# Altium schematic sheet Sheet1.SchDoc
size A4
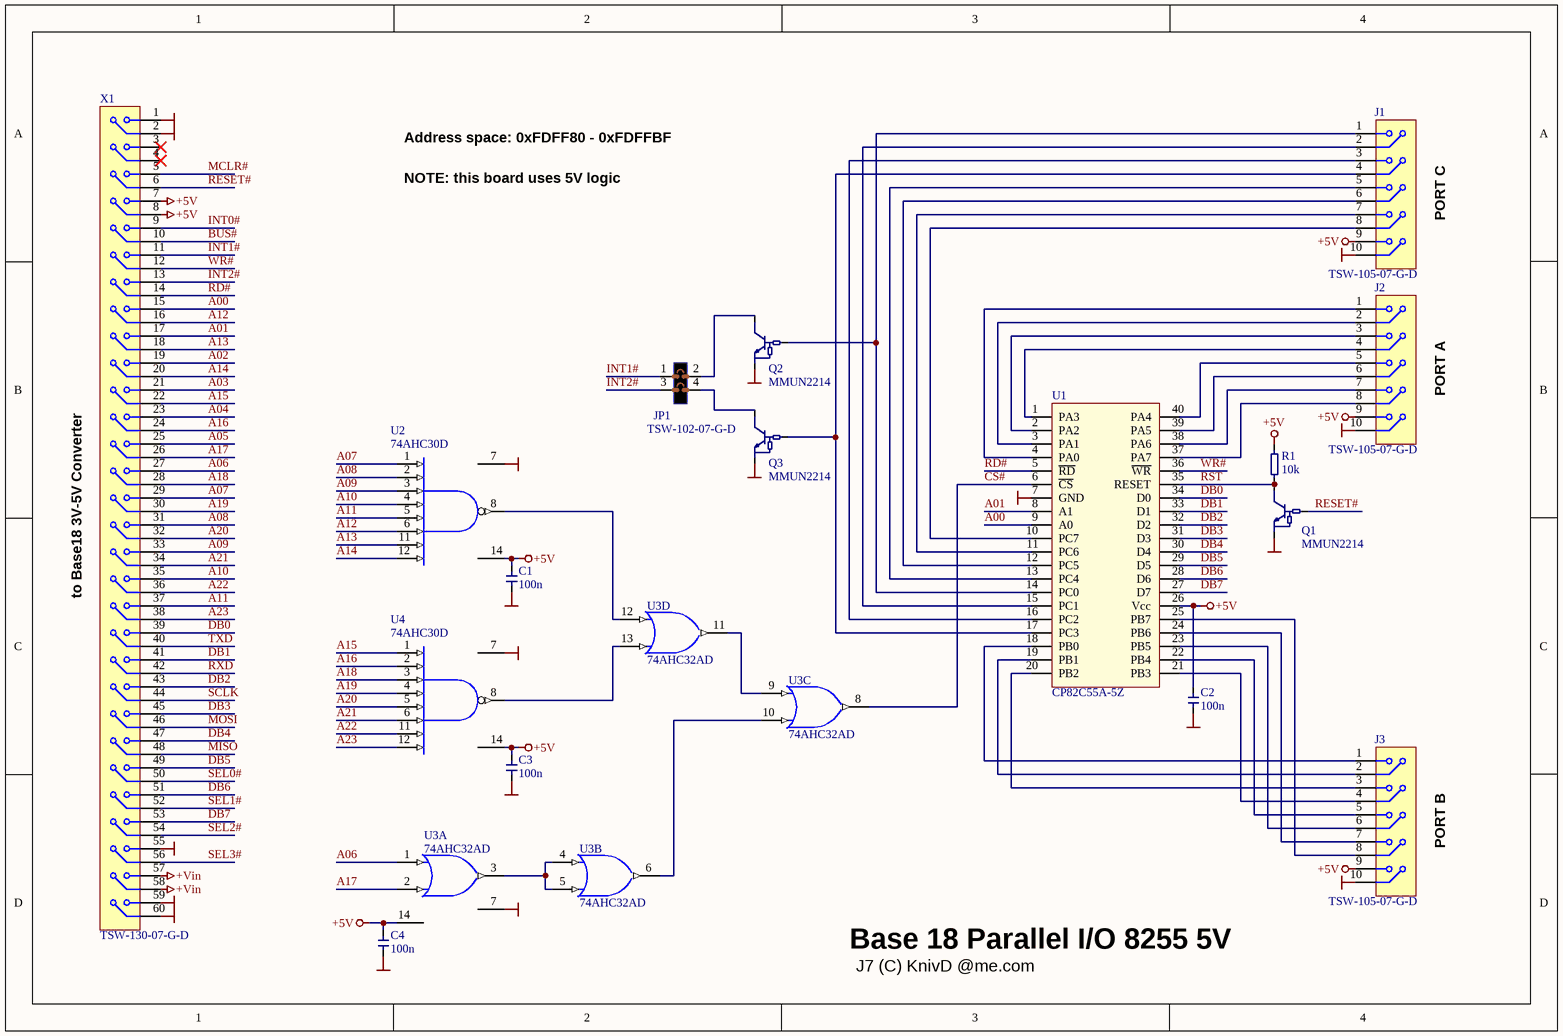
[diagram p0: Sheet1.SchDoc]

## Parts
C1  100n  [CAPC3216X110N]
C2  100n  [CAPC3216X110N]
C3  100n  [CAPC3216X110N]
C4  100n  [CAPC3216X110N]
J1  TSW-105-07-G-D  [2011-2X05S]
J2  TSW-105-07-G-D  [2011-2X05S]
J3  TSW-105-07-G-D  [2011-2X05S]
JP1  TSW-102-07-G-D  [2011-2X02S]
Q1  MMUN2214  [SOT23-3]
Q2  MMUN2214  [SOT23-3]
Q3  MMUN2214  [SOT23-3]
R1  10k  [RESC3216X75N]
U1  CP82C55A-5Z  [DIP40-600]
U2  74AHC30D  [SOIC14]
U3  74AHC32AD  [SOIC14]  (parts A,B,C,D of 4)
U4  74AHC30D  [SOIC14]
X1  TSW-130-07-G-D  [DIL60-M-EDGE]

## Nets
+5V: C1.2 C2.2 C3.2 C4.2 J1.9 J2.9 J3.9 R1.1 U1.26(Vcc) U2.14(VCC) U3.14(VCC) U4.14(VCC) X1.7 X1.8  [also labelled VCC]
+Vin: X1.57 X1.58
GND: C1.1 C2.1 C3.1 C4.1 J1.10 J2.10 J3.10 Q1.2(E) Q2.2(E) Q3.2(E) U1.7(GND) U2.7(GND) U3.7(GND) U4.7(GND) X1.1 X1.2 X1.55 X1.59 X1.60
A00: U1.9(A0) X1.15
A01: U1.8(A1) X1.17
A02: X1.19
A03: X1.21
A04: X1.23
A05: X1.25
A06: U3.1 X1.27
A07: U2.1 X1.29
A08: U2.2 X1.31
A09: U2.3 X1.33
A10: U2.4 X1.35
A11: U2.5 X1.37
A12: U2.6 X1.16
A13: U2.11 X1.18
A14: U2.12 X1.20
A15: U4.1 X1.22
A16: U4.2 X1.24
A17: U3.2 X1.26
A18: U4.3 X1.28
A19: U4.4 X1.30
A20: U4.5 X1.32
A21: U4.6 X1.34
A22: U4.11 X1.36
A23: U4.12 X1.38
BUS#: X1.10
CS#: U1.6(~{CS}) U3.8(Y)
DB0: U1.34(D0) X1.39
DB1: U1.33(D1) X1.41
DB2: U1.32(D2) X1.43
DB3: U1.31(D3) X1.45
DB4: U1.30(D4) X1.47
DB5: U1.29(D5) X1.49
DB6: U1.28(D6) X1.51
DB7: U1.27(D7) X1.53
INT0#: X1.9
INT1#: JP1.1 X1.11
INT2#: JP1.3 X1.13
MCLR#: X1.5
MISO: X1.48
MOSI: X1.46
RD#: U1.5(~{RD}) X1.14
RESET#: Q1.1(B) X1.6
RST: Q1.3(C) R1.2 U1.35(RESET)
RXD: X1.42
SCLK: X1.44
SEL0#: X1.50
SEL1#: X1.52
SEL2#: X1.54
SEL3#: X1.56
TXD: X1.40
WR#: U1.36(~{WR}) X1.12
NetJ1_1: J1.1 Q2.1(B) U1.14(PC0)
NetJ1_2: J1.2 U1.15(PC1)
NetJ1_3: J1.3 U1.16(PC2)
NetJ1_4: J1.4 Q3.1(B) U1.17(PC3)
NetJ1_5: J1.5 U1.13(PC4)
NetJ1_6: J1.6 U1.12(PC5)
NetJ1_7: J1.7 U1.11(PC6)
NetJ1_8: J1.8 U1.10(PC7)
NetJ2_1: J2.1 U1.4(PA0)
NetJ2_2: J2.2 U1.3(PA1)
NetJ2_3: J2.3 U1.2(PA2)
NetJ2_4: J2.4 U1.1(PA3)
NetJ2_5: J2.5 U1.40(PA4)
NetJ2_6: J2.6 U1.39(PA5)
NetJ2_7: J2.7 U1.38(PA6)
NetJ2_8: J2.8 U1.37(PA7)
NetJ3_1: J3.1 U1.18(PB0)
NetJ3_2: J3.2 U1.19(PB1)
NetJ3_3: J3.3 U1.20(PB2)
NetJ3_4: J3.4 U1.21(PB3)
NetJ3_5: J3.5 U1.22(PB4)
NetJ3_6: J3.6 U1.23(PB5)
NetJ3_7: J3.7 U1.24(PB6)
NetJ3_8: J3.8 U1.25(PB7)
NetJP1_2: JP1.2 Q2.3(C)
NetJP1_4: JP1.4 Q3.3(C)
NetU2_8: U2.8 U3.12(A)
NetU3_3: U3.3 U3.4(A) U3.5(B)
NetU3_6: U3.6(Y) U3.10(B)
NetU3_9: U3.9(A) U3.11(Y)
NetU3_13: U3.13(B) U4.8

Not connected (* = marked no-connect by the designer): X1 3* 4*

## Notes on the sheet
- Address space: 0xFDFF80 - 0xFDFFBF
- NOTE: this board uses 5V logic
- PORT C
- PORT A
- to Base18 3V-5V Converter
- PORT B
- Base 18 Parallel I/O 8255 5V
- J7 (C) KnivD @me.com

## Library data of the parts
C1-C4 = Capacitor
J1-J3 = Connector 2x5: Dual row, 10-way connector
JP1 = Jumper 2x2: 2.54mm square pin header/jumper
Q1-Q3 = NPN BIASED: NPN biased bipolar transistor
R1 = Resistor
U1 = 82C55A DIP40: CMOS Programmable Peripheral Interface; Manufacturer: Renesas
U2 U4 = 74HCT30N: 8-Input NAND Gate; Manufacturer: NXP SEMICONDUCTORS; Table: Standard Logic; Part Number: 74HCT30N; Component Kind: Standard; Component Type: Standard; Device: 74HCT30N; Footprint: DIP14-300; PackageDescription: DIP; 14 Leads; Row Spacing 7.62 mm; Pitch 2.54 mm; Part Description: 8-Input NAND Gate; Manufacturer Part Number: 74HCT30N; Pin Count: 11; Case: DIP14-300; Mounted: Yes; Socket: Yes; SMD: No; ComponentHeight: 4.2mm; Author: CERN DEM JLC; HelpURL: \\cern.ch\dfs\Applications\Altium\Datasheets\74HCT30N.pdf; CreateDate: 11/12/2012; LatestRevisionDate: 11/12/2012
U3 = 74HCT32N: Quad 2-Input OR Gate; Manufacturer: NXP SEMICONDUCTORS; Table: Standard Logic; Part Number: 74HCT32N; Component Kind: Standard; Component Type: Standard; Device: 74HCT32N; Footprint: DIP14-300; PackageDescription: DIP; 14 Leads; Row Spacing 7.62 mm; Pitch 2.54 mm; Part Description: Quad 2-Input OR Gate; Manufacturer Part Number: 74HCT32N; Pin Count: 14; Case: DIP14-300; Mounted: Yes; Socket: Yes; SMD: No; ComponentHeight: 4.2mm; Author: CERN DEM JLC; HelpURL: \\cern.ch\dfs\Applications\Altium\Datasheets\74HCT32N.pdf; CreateDate: 11/12/2012; LatestRevisionDate: 11/12/2012
X1 = Connector 2x30: Dual row, 60-way connector